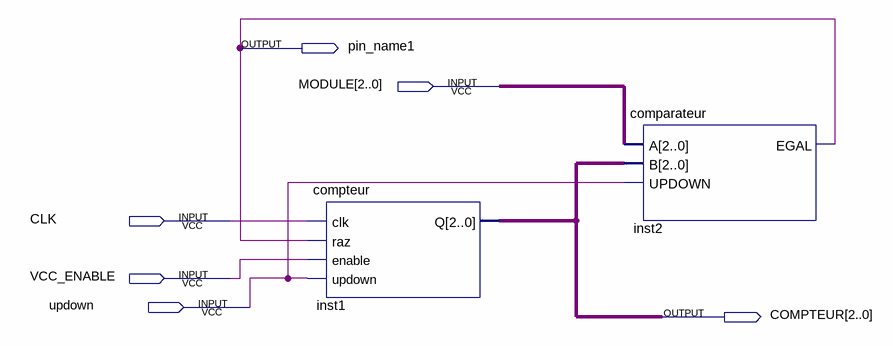
[diagram p0: schematic sheet]
// Quartus schematic sequenceur.bdf as structural Verilog: 2 symbols, 6 pins
module sequenceur (
  input  [2:0] MODULE,
  input  CLK,
  input  VCC_ENABLE,
  input  updown,
  output pin_name1,
  output [2:0] COMPTEUR
);

  compteur inst1 (.clk(CLK), .raz(pin_name1), .enable(VCC_ENABLE), .updown(updown), .Q(COMPTEUR));
  comparateur inst2 (.A(MODULE), .B(COMPTEUR), .UPDOWN(updown), .EGAL(pin_name1));
endmodule
